# Altium schematic sheet 2_NAND-eMMC.schdoc
size 297 x 209 mm; Symbol: tv_muban1_1; Company: 嘉立创EDA; Version: V1.0; Page Size: A4; @Project Name: LCEDAsucaiku; @Update Date: 2026-05-01; @Create Date: 2026-03-27; @Page Name: NAND-eMMC; @Page Count: 8; @Page No: 2; @Update Time: 18:37:06; Color: #990000; Device: sucai_muban; @Board Name: tv基板; @Create Time: 22:33:53; @Schematic Name: Schematic1; @Assembly Variant: Basic; Border: 1; Title Block Position: 3; Size: A4; Width: 1170; Height: 825; Region Start: 1; X Region Count: 6; Y Region Count: 4; Blade Width: 10; SheetNumber: 2; SheetTotal: 8
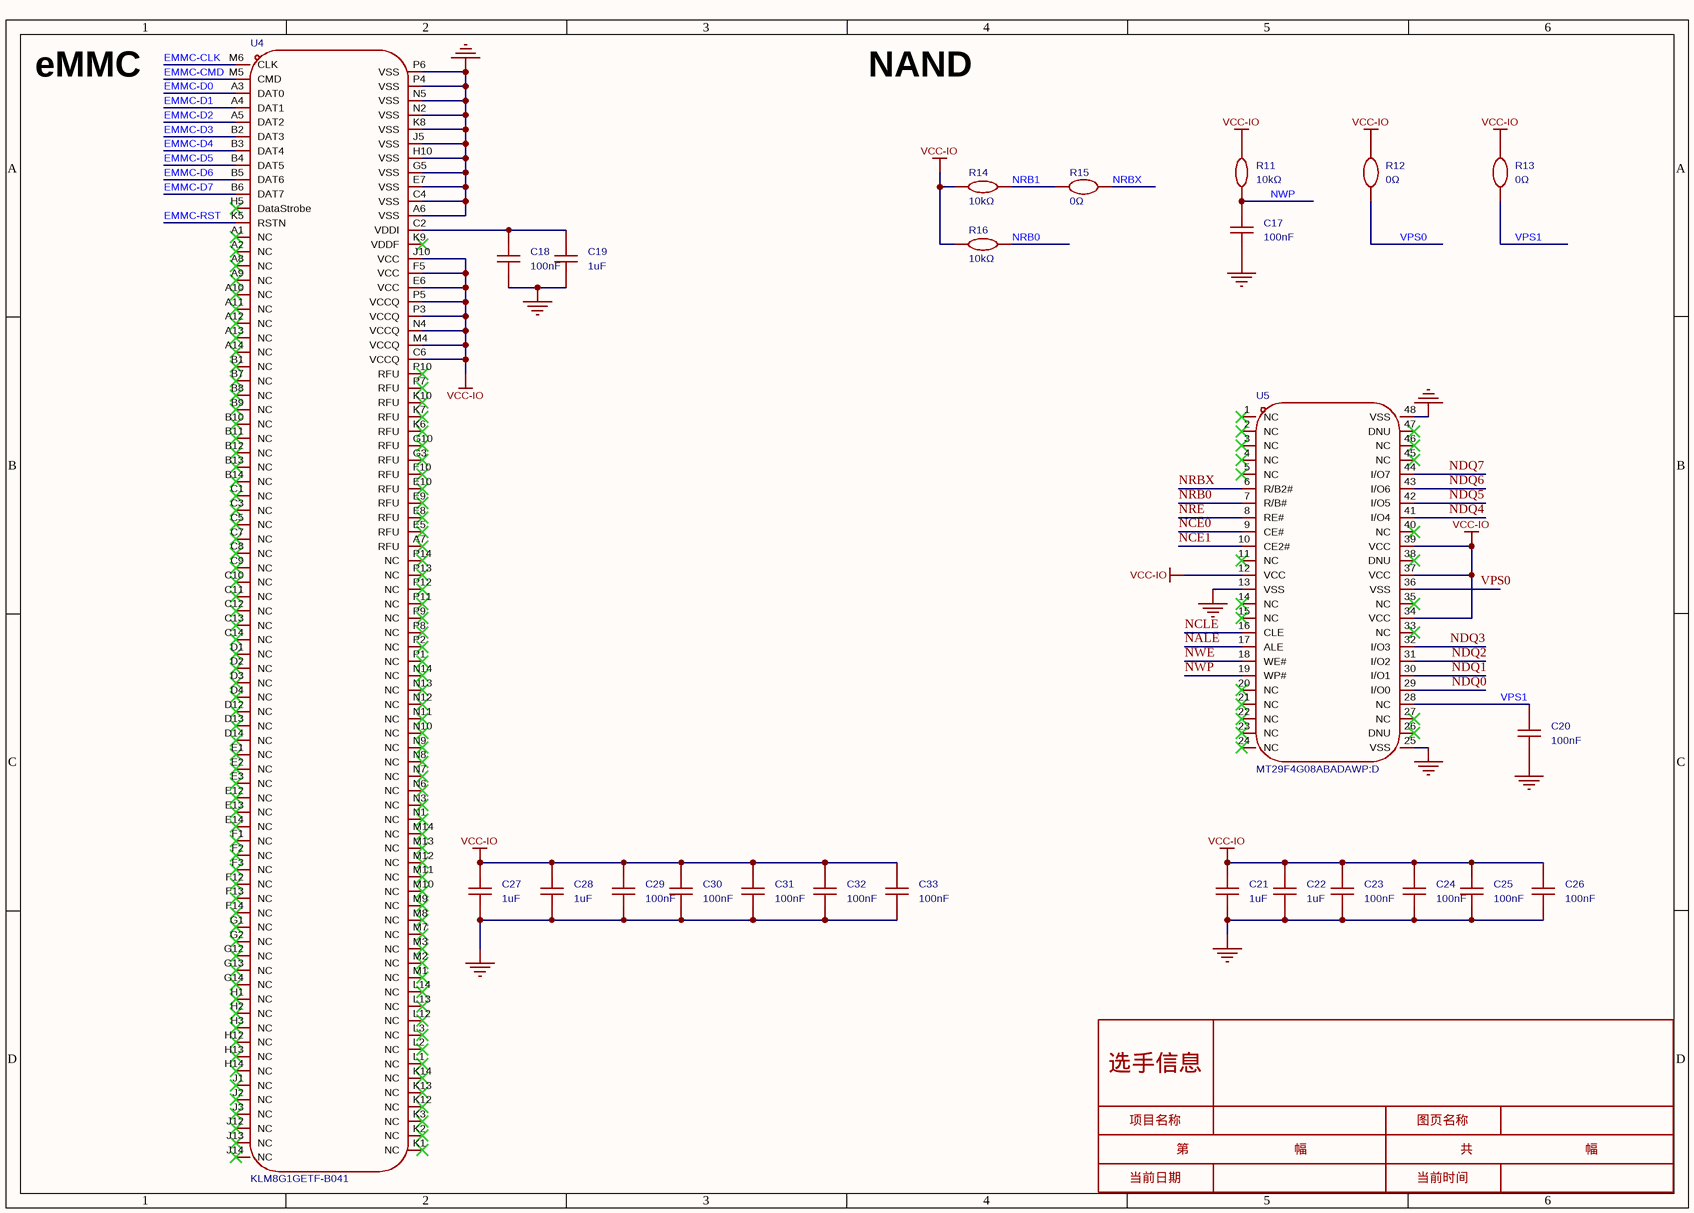
[diagram p0: 2_NAND-eMMC.schdoc]

## Parts
C17  100nF  [C0402]
C18  100nF  [C0402]
C19  1uF  [C0402]
C20  100nF  [C0402]
C21  1uF  [C0402]
C22  1uF  [C0402]
C23  100nF  [C0402]
C24  100nF  [C0402]
C25  100nF  [C0402]
C26  100nF  [C0402]
C27  1uF  [C0402]
C28  1uF  [C0402]
C29  100nF  [C0402]
C30  100nF  [C0402]
C31  100nF  [C0402]
C32  100nF  [C0402]
C33  100nF  [C0402]
R11  10kΩ  [R0402]
R12  0Ω  [R0402]
R13  0Ω  [R0402]
R14  10kΩ  [R0402]
R15  0Ω  [R0402]
R16  10kΩ  [R0402]
U4  KLM8G1GETF-B041  [FBGA-153_L13.0-W11.5-P0.50_KLMAG1JETD-B041]
U5  MT29F4G08ABADAWP:D  [TSOP-48_L18.5-W12.2-P0.50-LS20.0-TL]

## Nets
GND: C17.2 C18.2 C19.2 C20.2 C21.2 C22.2 C23.2 C24.2 C25.2 C26.2 C27.2 C28.2 C29.2 C30.2 C31.2 C32.2 C33.2 U4.A6(VSS) U4.C4(VSS) U4.E7(VSS) U4.G5(VSS) U4.H10(VSS) U4.J5(VSS) U4.K8(VSS) U4.N2(VSS) U4.N5(VSS) U4.P4(VSS) U4.P6(VSS) U5.13(VSS) U5.25(VSS) U5.48(VSS)
VCC-IO: C21.1 C22.1 C23.1 C24.1 C25.1 C26.1 C27.1 C28.1 C29.1 C30.1 C31.1 C32.1 C33.1 R11.2 R12.2 R13.2 R14.2 R16.2 U4.C6(VCCQ) U4.E6(VCC) U4.F5(VCC) U4.J10(VCC) U4.M4(VCCQ) U4.N4(VCCQ) U4.P3(VCCQ) U4.P5(VCCQ) U5.12(VCC) U5.34(VCC) U5.37(VCC) U5.39(VCC)
EMMC-CLK: U4.M6(CLK)
EMMC-CMD: U4.M5(CMD)
EMMC-D0: U4.A3(DAT0)
EMMC-D1: U4.A4(DAT1)
EMMC-D2: U4.A5(DAT2)
EMMC-D3: U4.B2(DAT3)
EMMC-D4: U4.B3(DAT4)
EMMC-D5: U4.B4(DAT5)
EMMC-D6: U4.B5(DAT6)
EMMC-D7: U4.B6(DAT7)
EMMC-RST: U4.K5(RSTN)
NALE: U5.17(ALE)
NCE0: U5.9(CE#)
NCE1: U5.10(CE2#)
NCLE: U5.16(CLE)
NDQ0: U5.29(I/O0)
NDQ1: U5.30(I/O1)
NDQ2: U5.31(I/O2)
NDQ3: U5.32(I/O3)
NDQ4: U5.41(I/O4)
NDQ5: U5.42(I/O5)
NDQ6: U5.43(I/O6)
NDQ7: U5.44(I/O7)
NRB0: R16.1 U5.7(R/B#)
NRB1: R14.1 R15.2
NRBX: R15.1 U5.6(R/B2#)
NRE: U5.8(RE#)
NWE: U5.18(WE#)
NWP: C17.1 R11.1 U5.19(WP#)
VPS0: R12.1 U5.36(VSS)
VPS1: C20.1 R13.1 U5.28(NC)
NetC18_1: C18.1 C19.1 U4.C2(VDDI)

Not connected (* = marked no-connect by the designer): U4 A1(NC)* A2(NC)* A7(RFU)* A8(NC)* A9(NC)* A10(NC)* A11(NC)* A12(NC)* A13(NC)* A14(NC)* B1(NC)* B7(NC)* B8(NC)* B9(NC)* B10(NC)* B11(NC)* B12(NC)* B13(NC)* B14(NC)* C1(NC)* C3(NC)* C5(NC)* C7(NC)* C8(NC)* C9(NC)* C10(NC)* C11(NC)* C12(NC)* C13(NC)* C14(NC)* D1(NC)* D2(NC)* D3(NC)* D4(NC)* D12(NC)* D13(NC)* D14(NC)* E1(NC)* E2(NC)* E3(NC)* E5(RFU)* E8(RFU)* E9(RFU)* E10(RFU)* E12(NC)* E13(NC)* E14(NC)* F1(NC)* F2(NC)* F3(NC)* F10(RFU)* F12(NC)* F13(NC)* F14(NC)* G1(NC)* G2(NC)* G3(RFU)* G10(RFU)* G12(NC)* G13(NC)* G14(NC)* H1(NC)* H2(NC)* H3(NC)* H5(DataStrobe)* H12(NC)* H13(NC)* H14(NC)* J1(NC)* J2(NC)* J3(NC)* J12(NC)* J13(NC)* J14(NC)* K1(NC)* K2(NC)* K3(NC)* K6(RFU)* K7(RFU)* K9(VDDF)* K10(RFU)* K12(NC)* K13(NC)* K14(NC)* L1(NC)* L2(NC)* L3(NC)* L12(NC)* L13(NC)* L14(NC)* M1(NC)* M2(NC)* M3(NC)* M7(NC)* M8(NC)* M9(NC)* M10(NC)* M11(NC)* M12(NC)* M13(NC)* M14(NC)* N1(NC)* N3(NC)* N6(NC)* N7(NC)* N8(NC)* N9(NC)* N10(NC)* N11(NC)* N12(NC)* N13(NC)* N14(NC)* P1(NC)* P2(NC)* P7(RFU)* P8(NC)* P9(NC)* P10(RFU)* P11(NC)* P12(NC)* P13(NC)* P14(NC)*; U5 1(NC)* 2(NC)* 3(NC)* 4(NC)* 5(NC)* 11(NC)* 14(NC)* 15(NC)* 20(NC)* 21(NC)* 22(NC)* 23(NC)* 24(NC)* 26(DNU)* 27(NC)* 33(NC)* 35(NC)* 38(DNU)* 40(NC)* 45(NC)* 46(NC)* 47(DNU)*

## Notes on the sheet
- eMMC
- NAND
- 选手信息
- 项目名称
- 第                              幅
- 图页名称
- 共                                幅
- 当前日期
- 当前时间

## Library data of the parts
C17 C18 C29 = CL05B104KO5NNNC: 容值:100nF;精度:±10%;额定电压:16V;温度系数:X7R;; Manufacturer: SAMSUNG(三星); AddInBom: yes; ModelId: 36a51122f27c49738f86b3bfa98863e0聨0819f05c4eef4c71ace90d822a990e87; ModelName: C0402_L1.0-W0.5-H0.5; ModelTransform: 39.37,19.685,0,0,0,0,0,0,0; Tolerance: ±10%; Voltage Rating: 16V; Temperature Coefficient: X7R; Symbol: CL05B104KO5NNNC; Device: CL05B104KO5NNNC; LCSC Part Name: 100nF ±10% 16V; SupplierPart: C1525; ManufacturerPart: CL05B104KO5NNNC; Supplier Footprint: 0402; JLCPCB Part Class: Basic Part; Datasheet: https://item.szlcsc.com/datasheet/CL05B104KO5NNNC/1877.html; Supplier: LCSC; ConvertToPcb: yes; FootprintName: C0402; Value: 100nF
C19 C27 C28 = CGA0402X5R105K500GT: 容值:1uF;精度:±10%;额定电压:50V;温度系数:X5R;; Manufacturer: HRE(芯声); AddInBom: yes; ModelId: 36a51122f27c49738f86b3bfa98863e0聨0819f05c4eef4c71ace90d822a990e87; ModelName: C0402_L1.0-W0.5-H0.5; ModelTransform: 39.37,19.685,0,0,0,0,0,0,0; Tolerance: ±10%; Voltage Rating: 50V; Temperature Coefficient: X5R; Symbol: CGA0402X5R105K500GT; Device: CGA0402X5R105K500GT; LCSC Part Name: 1uF ±10% 50V; SupplierPart: C6119811; ManufacturerPart: CGA0402X5R105K500GT; Supplier Footprint: 0402; JLCPCB Part Class: Extended Part; Datasheet: https://item.szlcsc.com/datasheet/CGA0402X5R105K500GT/7062517.html; Supplier: LCSC; ConvertToPcb: yes; FootprintName: C0402; Value: 1uF
C20 C23-C26 C30-C33 = CL05B104KO5NNNC: 容值:100nF;精度:±10%;额定电压:16V;温度系数:X7R;; Manufacturer: SAMSUNG(三星); 3D Model: 36a51122f27c49738f86b3bfa98863e0聨0819f05c4eef4c71ace90d822a990e87; 3D Model Transform: 39.37,19.685,0,0,0,0,0,0,0; Tolerance: ±10%; Voltage Rating: 16V; Temperature Coefficient: X7R; AddInBom: yes; ModelName: C0402_L1.0-W0.5-H0.5; Symbol: CL05B104KO5NNNC; Device: CL05B104KO5NNNC; LCSC Part Name: 100nF ±10% 16V; Supplier Part: C1525; Manufacturer Part: CL05B104KO5NNNC; Supplier Footprint: 0402; JLCPCB Part Class: Basic Part; Datasheet: https://item.szlcsc.com/datasheet/CL05B104KO5NNNC/1877.html; Supplier: LCSC; Value: 100nF; ConvertToPcb: yes; FootprintName: C0402
C21 C22 = CGA0402X5R105K500GT: 容值:1uF;精度:±10%;额定电压:50V;温度系数:X5R;; Manufacturer: HRE(芯声); 3D Model: 36a51122f27c49738f86b3bfa98863e0聨0819f05c4eef4c71ace90d822a990e87; 3D Model Transform: 39.37,19.685,0,0,0,0,0,0,0; Tolerance: ±10%; Voltage Rating: 50V; Temperature Coefficient: X5R; AddInBom: yes; ModelName: C0402_L1.0-W0.5-H0.5; Symbol: CGA0402X5R105K500GT; Device: CGA0402X5R105K500GT; LCSC Part Name: 1uF ±10% 50V; Supplier Part: C6119811; Manufacturer Part: CGA0402X5R105K500GT; Supplier Footprint: 0402; JLCPCB Part Class: Extended Part; Datasheet: https://item.szlcsc.com/datasheet/CGA0402X5R105K500GT/7062517.html; Supplier: LCSC; Value: 1uF; ConvertToPcb: yes; FootprintName: C0402
R11 R14 R16 = RC0402FR-0710KL: 电阻类型:厚膜电阻;阻值:10kΩ;精度:±1%;功率:62.5mW;工作电压:50V;温度系数:±100ppm/℃;; Manufacturer: YAGEO(国巨); AddInBom: yes; ModelId: 98c88bc2b9094f218f3a3e30a7012738聨0819f05c4eef4c71ace90d822a990e87; ModelName: R0402_L1.0-W0.5-H0.4; ModelTransform: 39.37,19.685,0,0,0,0,0,0,0; Tolerance: ±1%; Power(Watts): 62.5mW; Voltage-Supply(Max): 50V; Symbol: RC0402FR-0710KL; Device: RC0402FR-0710KL; LCSC Part Name: 厚膜电阻 10kΩ ±1% 62.5mW; SupplierPart: C60490; ManufacturerPart: RC0402FR-0710KL; Supplier Footprint: 0402; JLCPCB Part Class: Extended Part; Datasheet: https://item.szlcsc.com/datasheet/RC0402FR-0710KL/61542.html; Supplier: LCSC; ConvertToPcb: yes; FootprintName: R0402; Type: 厚膜电阻; Value: 10kΩ; Temperature Coefficient: ±100ppm/℃; Operating Temperature: -55℃~+155℃
R12 R13 R15 = FRC0402P000 TS: 电阻类型:厚膜电阻;阻值:0Ω;精度:±5%;功率:62.5mW;工作电压:50V;; Manufacturer: FOJAN(富捷); AddInBom: yes; ModelId: 98c88bc2b9094f218f3a3e30a7012738聨0819f05c4eef4c71ace90d822a990e87; ModelName: R0402_L1.0-W0.5-H0.4; ModelTransform: 39.37,19.685,0,0,0,0,0,0,0; Tolerance: ±5%; Power(Watts): 62.5mW; Voltage-Supply(Max): 50V; Symbol: FRC0402P000 TS; Device: FRC0402P000 TS; LCSC Part Name: 0Ω ±5% 62.5mW 厚膜电阻; SupplierPart: C2906877; ManufacturerPart: FRC0402P000 TS; Supplier Footprint: 0402; JLCPCB Part Class: Extended Part; Supplier: LCSC; ConvertToPcb: yes; FootprintName: R0402; Type: 厚膜电阻; Value: 0Ω; Operating Temperature: -55℃~+155℃
U4 = KLM8G1GETF-B041: 配置:-;接口类型:eMMC 5.1;存储容量:8GB;; Manufacturer: SAMSUNG(三星半导体); AddInBom: yes; ModelId: e295469cf8df408b9f13391ad06a16e8聨0819f05c4eef4c71ace90d822a990e87; ModelName: FBGA-153_L13.0-W11.5-H1.1-P0.50_KLMAG1JETD-B041; ModelTransform: 452.755,511.81,0,0,0,0,0,0,0; Memory Size: 8GB; Reading Speed in Sequence: 330MB/S; Writing Speed in Sequence: 50MB/S; NAND Operating Voltage (VCCF): 2.7V~3.6V; Controller Operating Voltage (VCCQ): 2.7V~3.6V；1.7V~1.95V; Symbol: KLM8G1GETF-B041; Device: KLM8G1GETF-B041; LCSC Part Name: eMMC 5.1 规格兼容; SupplierPart: C499918; ManufacturerPart: KLM8G1GETF-B041; Supplier Footprint: FBGA-153(11.5x13); JLCPCB Part Class: Extended Part; Datasheet: https://item.szlcsc.com/datasheet/KLM8G1GETF-B041/512098.html; Supplier: LCSC; ConvertToPcb: yes; FootprintName: FBGA-153_L13.0-W11.5-P0.50_KLMAG1JETD-B041; configuration: -; Interface: eMMC 5.1; Operating Temperature: -25℃~+85℃; NAND Stand-By Current: -; Controller Stand-By Current: -
U5 = MT29F4G08ABADAWP:D: 存储容量:4Gbit;时钟频率(fc):-;工作电压:2.7V~3.6V;; Manufacturer: micron(镁光); AddInBom: yes; ModelId: 84317263936c4cfc959f23406aa8adae聨0819f05c4eef4c71ace90d822a990e87; ModelName: TSOP-48_L12-W18.4-H1.0-LS20.0-P0.50; ModelTransform: 787.89433,472.44,0,0,0,0,0,0,0; Memory Size: 4Gbit; Interface: Parallel; Write Cycle Time(tWC): 20ns; Page Program time (TPP): 200us; Block Erase Time(tBE): 700us; Data Retention - TDR (Year): 10年; Program / Erase Cycles: 10万次; Symbol: MT29F4G08ABADAWP:D; Device: MT29F4G08ABADAWP:D; LCSC Part Name: MT29F4G08ABADAWP:D; SupplierPart: C78135; ManufacturerPart: MT29F4G08ABADAWP:D; Supplier Footprint: TSOPI-48; JLCPCB Part Class: Extended Part; Supplier: LCSC; ConvertToPcb: yes; FootprintName: TSOP-48_L18.5-W12.2-P0.50-LS20.0-TL; Clock Frequency: -; Voltage - Supply: 2.7V~3.6V; Operating Temperature: 0℃~+70℃; Standby Supply Current: -